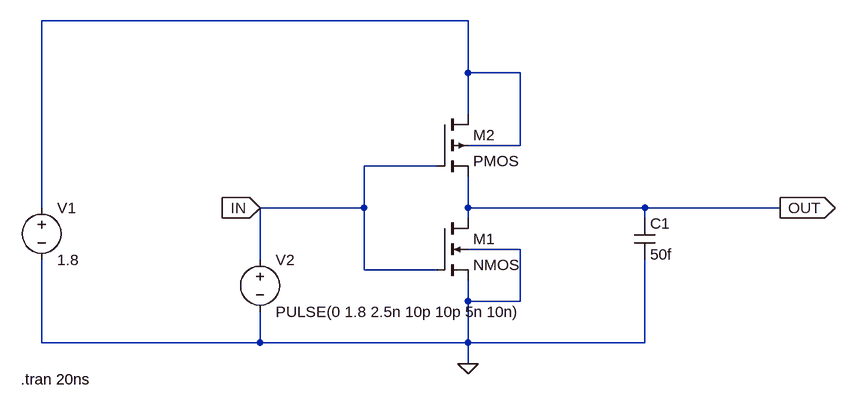
[diagram p0: schematic Draft1.asc]
Draft1.asc, the LTspice schematic file:
Version 4.1
SHEET 1 880 680
WIRE 80 -384 -576 -384
WIRE 80 -304 80 -384
WIRE 160 -304 80 -304
WIRE 80 -240 80 -304
WIRE 160 -192 160 -304
WIRE 160 -192 80 -192
WIRE 32 -160 -80 -160
WIRE -576 -96 -576 -384
WIRE -80 -96 -80 -160
WIRE -80 -96 -240 -96
WIRE 80 -96 80 -144
WIRE 352 -96 80 -96
WIRE 560 -96 352 -96
WIRE 80 -80 80 -96
WIRE 352 -80 352 -96
WIRE 160 -32 80 -32
WIRE -240 -16 -240 -96
WIRE -80 0 -80 -96
WIRE 32 0 -80 0
WIRE 80 48 80 16
WIRE 160 48 160 -32
WIRE 160 48 80 48
WIRE -576 112 -576 -16
WIRE -240 112 -240 64
WIRE -240 112 -576 112
WIRE 80 112 80 48
WIRE 80 112 -240 112
WIRE 352 112 352 -16
WIRE 352 112 80 112
WIRE 80 144 80 112
FLAG 80 144 0
FLAG -240 -96 IN
IOPIN -240 -96 In
FLAG 560 -96 OUT
IOPIN 560 -96 Out
SYMBOL nmos4 32 -80 R0
SYMATTR InstName M1
SYMATTR Value2 l=180n w=360n
SYMBOL pmos4 32 -240 R0
SYMATTR InstName M2
SYMATTR Value2 l=180n w=720n
SYMBOL cap 336 -80 R0
SYMATTR InstName C1
SYMATTR Value 50f
SYMBOL voltage -576 -112 R0
WINDOW 123 0 0 Left 0
WINDOW 39 0 0 Left 0
SYMATTR InstName V1
SYMATTR Value 1.8
SYMBOL voltage -240 -32 R0
WINDOW 123 0 0 Left 0
WINDOW 39 0 0 Left 0
SYMATTR InstName V2
SYMATTR Value PULSE(0 1.8 2.5n 10p 10p 5n 10n)
TEXT -608 168 Left 2 !.tran 20ns

The netlist it stands for:
* Draft1.asc
M1 OUT IN 0 0 NMOS l=180n w=360n
M2 N001 IN OUT N001 PMOS l=180n w=720n
C1 OUT 0 50f
V1 N001 0 1.8
V2 IN 0 PULSE(0 1.8 2.5n 10p 10p 5n 10n)
.model NMOS NMOS
.model PMOS PMOS
.lib standard.mos
.tran 20ns
.backanno
.end

* Results of the author's LTspice run, read from the files saved beside the schematic
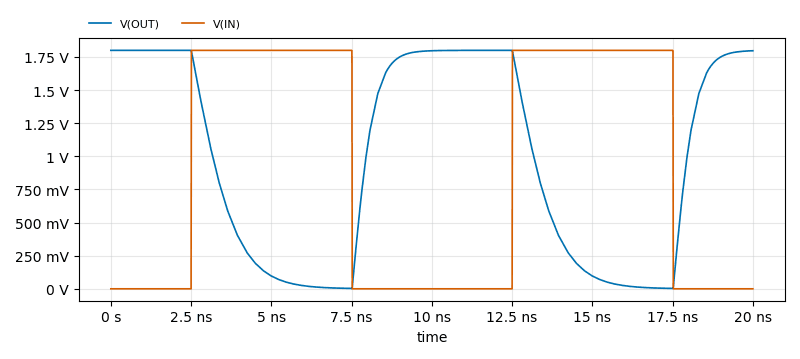
[diagram p1: Transient Analysis of Draft1.asc, plotted from the saved traces]
* Transient Analysis, 1 run:
*   V(OUT): min 2.671 mV, max 1.8 V, average 985.1 mV, rms 1.252 V, last 1.797 V
*   V(IN): min 0 V, max 1.8 V, average 901.8 mV, rms 1.274 V, last 0 V